# Altium schematic sheet Stepper Motor1.SchDoc
size A2; SheetNumber: 4; SheetTotal: 7
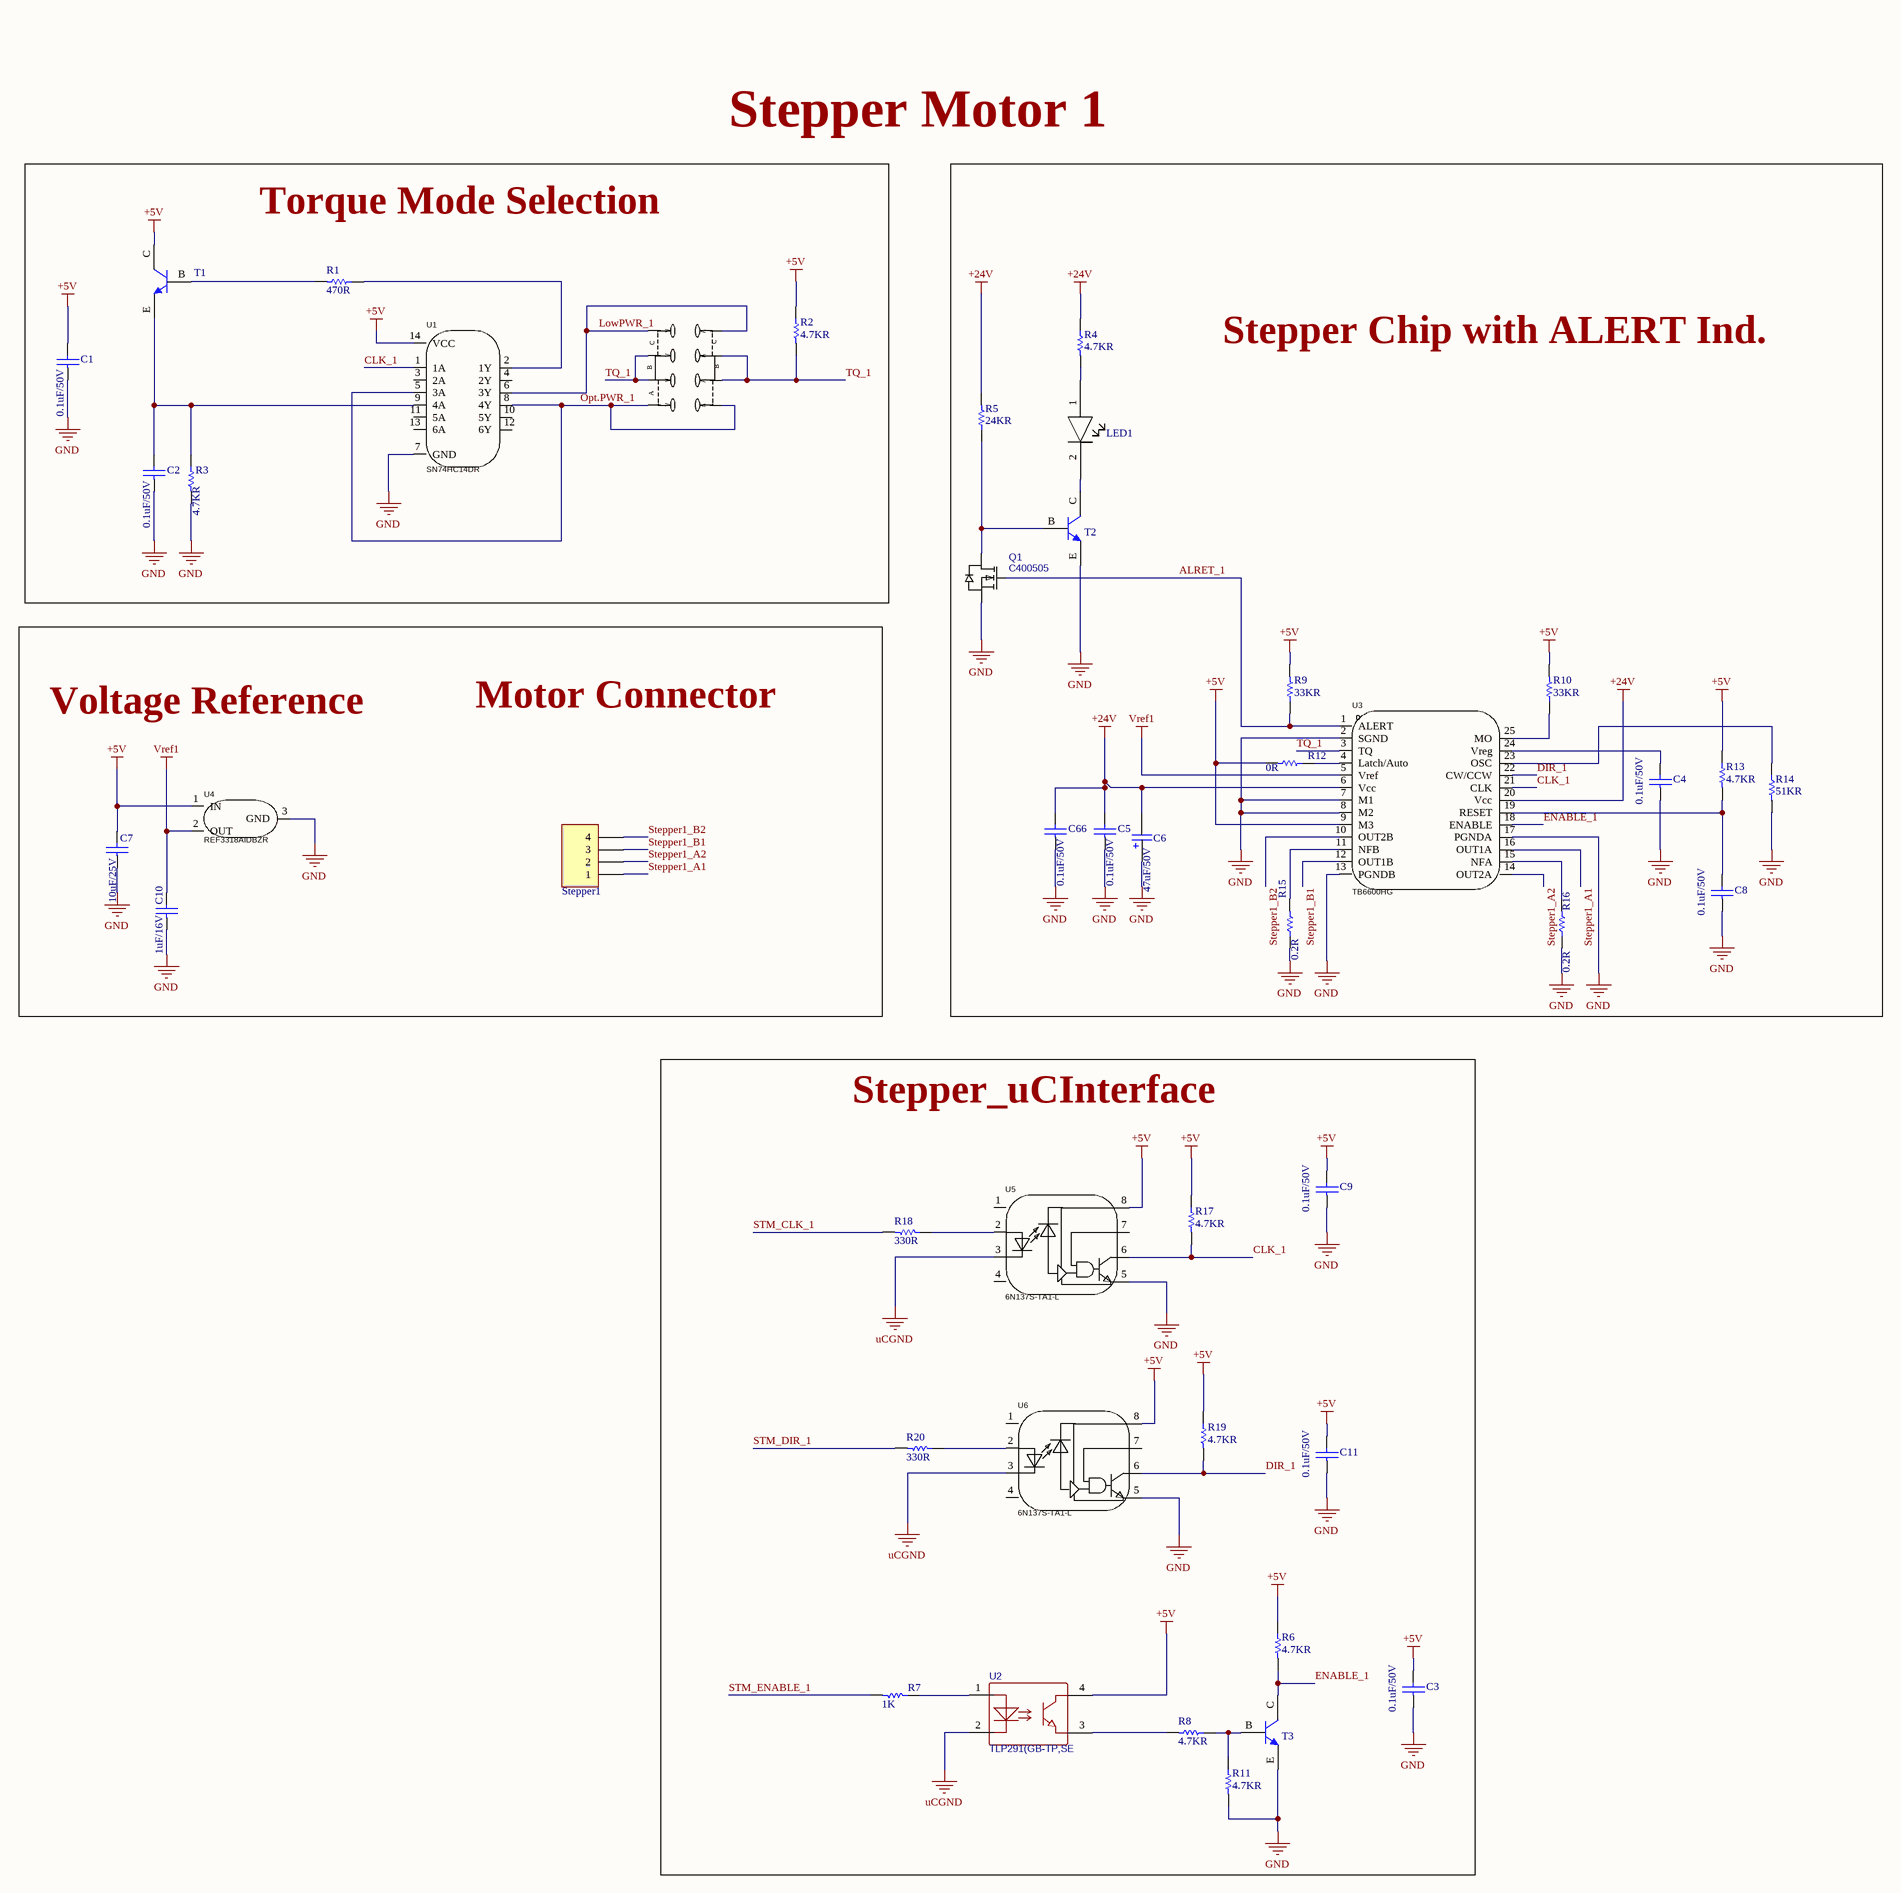
[diagram p0: Stepper Motor1.SchDoc]

## Parts
C1  0.1uF/50V  [PCBComponent_1]
C2  0.1uF/50V  [PCBComponent_1]
C3  0.1uF/50V  [PCBComponent_1]
C4  0.1uF/50V  [PCBComponent_1]
C5  0.1uF/50V  [PCBComponent_1]
C6  47uF/50V  [CAPLEAD_D6.3mm]  (no BOM)
C7  10uF/25V  [PCBComponent_1]
C8  0.1uF/50V  [PCBComponent_1]
C9  0.1uF/50V  [PCBComponent_1]
C10  1uF/16V  [PCBComponent_1]
C11  0.1uF/50V  [PCBComponent_1]
C66  0.1uF/50V  [PCBComponent_1]
LED1  1206 LED  [1206 LED]  (value not drawn)
Q1  C400505  [SOT-23-3_L2.9-W1.3-P1.90-LS2.4-BR]
R1  470R  [RESC1608X06N]
R2  4.7KR  [R0402]
R3  4.7KR  [R0402]
R4  4.7KR  [R0402]
R5  24KR  [RESC1608X06N]
R6  4.7KR  [R0402]
R7  1K  [R0402]
R8  4.7KR  [R0402]
R9  33KR  [RESC1608X06N]
R10  33KR  [RESC1608X06N]
R11  4.7KR  [R0402]
R12  0R  [RESC1608X06N]
R13  4.7KR  [R0402]
R14  51KR  [R0402]
R15  0.2R  [RESC6431X12N]
R16  0.2R  [RESC6431X12N]
R17  4.7KR  [R0402]
R18  330R  [R0402]
R19  4.7KR  [R0402]
R20  330R  [R0402]
Stepper1  Header 4 Pin Polar  [PCBComponent_1]  (value not drawn)  (no BOM)
SW1  MST23D19G2  [SW-SMD_MST23D19G2]  (value not drawn)
T1  MMBT3904 Transistor  [MMBT3904]  (value not drawn)
T2  MMBT3904 Transistor  [MMBT3904]  (value not drawn)
T3  MMBT3904 Transistor  [MMBT3904]  (value not drawn)
U1  SN74HC14DR  [SOIC-14_L8.7-W3.9-P1.27-LS6.0-BL]
U2  TLP291(GB-TP,SE  [SOP-4-1.27mm]
U3  TB6600HG  [HZIP25-P-1.00F]  (no BOM)
U4  REF3318AIDBZR  [SOT-23-3_L2.9-W1.3-P1.90-LS2.4-BR]
U5  6N137S-TA1-L  [SOP-8_L9.8-W6.6-P2.54-LS10.3-BL]
U6  6N137S-TA1-L  [SOP-8_L9.8-W6.6-P2.54-LS10.3-BL]

## Blocks framed on the sheet
Torque Mode Selection: C1 C2 R1-R3 SW1 T1 U1
Stepper Chip with ALERT Ind.: C4-C6 C8 C66 LED1 Q1 R4 R5 R9 R10 R12-R16 T2 U3
Stepper_uCInterface: C3 C9 C11 R6-R8 R11 R17-R20 T3 U2 U5 U6

## Nets
+5V: C1.2 C3.2 C7.2 C9.2 C11.2 R2.1 R6.1 R9.2 R10.2 R12.2 R13.1 R17.1 R19.1 T1.C U1.14(VCC) U2.4 U3.9(M3) U4.1(IN) U5.8 U6.8
+24V: C5.2 C6.2 C66.2 R4.1 R5.2 U3.6(Vcc) U3.20(Vcc)
GND: C1.1 C2.1 C3.1 C4.1 C5.1 C6.1 C7.1 C8.1 C9.1 C10.1 C11.1 C66.1 Q1.2(S) R3.2 R11.2 R14.2 R15.1 R16.1 T2.E T3.E U1.7(GND) U3.2(SGND) U3.7(M1) U3.8(M2) U3.13(PGNDB) U3.17(PGNDA) U4.3(GND) U5.5 U6.5
uCGND: U2.2 U5.3 U6.3
Vref1: C10.2 U3.5(Vref) U4.2(OUT)
ALRET_1: Q1.1(G) R9.1 U3.1(ALERT)
CLK_1: R17.2 U1.1(1A) U3.21(CLK) U5.6
DIR_1: R19.2 U3.22(CW/CCW) U6.6
ENABLE_1: R6.2 T3.C U3.18(ENABLE)
LowPWR_1: SW1.4 SW1.5 U1.6(3Y)
Opt.PWR_1: SW1.1 SW1.8 U1.5(3A) U1.8(4Y)
Stepper1_A1: Stepper1.1 U3.16(OUT1A)
Stepper1_A2: Stepper1.2 U3.14(OUT2A)
Stepper1_B1: Stepper1.3 U3.12(OUT1B)
Stepper1_B2: Stepper1.4 U3.10(OUT2B)
STM_CLK_1: R18.2
STM_DIR_1: R20.2
STM_ENABLE_1: R7.2
TQ_1: R2.2 SW1.2 SW1.3 SW1.6 SW1.7 U3.3(TQ)
NetC2_2: C2.2 R3.1 T1.E U1.9(4A)
NetC4_2: C4.2 U3.24(Vreg)
NetC8_2: C8.2 R13.2 U3.19(RESET)
NetLED1_1: LED1.1 R4.2
NetLED1_2: LED1.2 T2.C
NetQ1_3: Q1.3(D) R5.1 T2.B
NetR1_1: R1.1 U1.2(1Y)
NetR1_2: R1.2 T1.B
NetR7_1: R7.1 U2.1
NetR8_1: R8.1 R11.1 T3.B
NetR8_2: R8.2 U2.3
NetR10_1: R10.1 U3.25(MO)
NetR12_1: R12.1 U3.4(Latch/Auto)
NetR14_1: R14.1 U3.23(OSC)
NetR15_2: R15.2 U3.11(NFB)
NetR16_2: R16.2 U3.15(NFA)
NetR18_1: R18.1 U5.2
NetR20_1: R20.1 U6.2

Not connected (* = marked no-connect by the designer): U1 3(2A) 4(2Y) 10(5Y) 11(5A) 12(6Y) 13(6A); U5 1(NC) 4(NC) 7; U6 1(NC) 4(NC) 7

## Notes on the sheet
- Stepper Motor 1
- Voltage Reference
- Motor Connector
- (in symbol MST23D19G2) C; B; A

## Library data of the parts
C1-C5 C8 C9 C11 C66 = 0603 Capacitor: C1591; Created By: NourAldin; DataSheet Link: https://eu.mouser.com/datasheet/2/400/lcc_automotive_general_en-843974.pdf; Mouser Link: https://eu.mouser.com/ProductDetail/TDK/CGA1A2X7R1H331M030BA?qs=sGAEpiMZZMs0AnBnWHyRQL8L3bkL%252bvtyS9XpSB1mk7rVV5K8%252bbxEeg%3d%3d
C6 = A759EQ475M2AAAE160: C45100; Manufacturer: KEMET; Supplier 1: Mouser; Manufacturer Part Number: A759EQ475M2AAAE160; RoHS: Yes; Category: Polymer Capacitors; Stock 1: 17219; Pricing 1: 1=0.97, 10=0.73, 50=0.73, 100=0.546, 1000=0.384, 10000=0.326 (USD); ComponentLink1URL: http://www.kemet.com/docfinder?Partnumber=A759EQ475M2AAAE160&src-supplier=Digikey; ComponentLink1Description: http://www.kemet.com/docfinder?Partnumber=A759EQ475M2AAAE160&src-supplier=Digikey; ComponentLink2URL: http://www.farnell.com/datasheets/2095614.pdf?src-supplier=Element14; ComponentLink2Description: http://www.farnell.com/datasheets/2095614.pdf?src-supplier=Element14; Supplier Part Number 1: 80-A759EQ475M2AAE160
C7 = 0603 Capacitor: C96446; Created By: NourAldin; DataSheet Link: https://eu.mouser.com/datasheet/2/400/lcc_automotive_general_en-843974.pdf; Mouser Link: https://eu.mouser.com/ProductDetail/TDK/CGA1A2X7R1H331M030BA?qs=sGAEpiMZZMs0AnBnWHyRQL8L3bkL%252bvtyS9XpSB1mk7rVV5K8%252bbxEeg%3d%3d
C10 = 0603 Capacitor: C1592; Created By: NourAldin; DataSheet Link: https://eu.mouser.com/datasheet/2/400/lcc_automotive_general_en-843974.pdf; Mouser Link: https://eu.mouser.com/ProductDetail/TDK/CGA1A2X7R1H331M030BA?qs=sGAEpiMZZMs0AnBnWHyRQL8L3bkL%252bvtyS9XpSB1mk7rVV5K8%252bbxEeg%3d%3d
LED1 = 1206 LED: C434438; Created By: NourAldin
Q1 = BSS138_MOSFET: Manufacturer: YANGJIE(扬杰); Manufacturer Part: BSS138; Contributor: LCSC; Supplier: LCSC; Supplier Part: C400505; JLCPCB Part Class: Extended Part; spicePre: Q; spiceSymbolName: BSS138_C400505
R1 = 0603 Resistor: C114669; Created By: NourAldin; Mouser Link: https://eu.mouser.com/ProductDetail/Panasonic/ERA-3AHD180V?qs=sGAEpiMZZMvdGkrng054t5mej2KPdPuFSlDBd1tSiF0%3d; DataSheet Link: https://eu.mouser.com/datasheet/2/315/AOA0000C307-1149632.pdf
R2-R4 R6 R8 R11 R13 R17 R19 = 0402 Resistor: C105871
R5 = 0603 Resistor: C2930081; Created By: NourAldin; Mouser Link: https://eu.mouser.com/ProductDetail/Panasonic/ERA-3AHD180V?qs=sGAEpiMZZMvdGkrng054t5mej2KPdPuFSlDBd1tSiF0%3d; DataSheet Link: https://eu.mouser.com/datasheet/2/315/AOA0000C307-1149632.pdf
R7 = 0402 Resistor: C106235
R9 R10 = 0603 Resistor: C126359; Created By: NourAldin; Mouser Link: https://eu.mouser.com/ProductDetail/Panasonic/ERA-3AHD180V?qs=sGAEpiMZZMvdGkrng054t5mej2KPdPuFSlDBd1tSiF0%3d; DataSheet Link: https://eu.mouser.com/datasheet/2/315/AOA0000C307-1149632.pdf
R12 = 0603 Resistor: C100044; Created By: NourAldin; Mouser Link: https://eu.mouser.com/ProductDetail/Panasonic/ERA-3AHD180V?qs=sGAEpiMZZMvdGkrng054t5mej2KPdPuFSlDBd1tSiF0%3d; DataSheet Link: https://eu.mouser.com/datasheet/2/315/AOA0000C307-1149632.pdf
R14 = 0402 Resistor: C107230
R15 R16 = 2512 Resistor: C2903473; Created By: NourAldin; Mouser Link: https://eu.mouser.com/ProductDetail/Bourns/CSS2H-2512K-2L00F?qs=sGAEpiMZZMukHu%252bjC5l7YewuupLM8jZrvWs15Y6t0rY%3D&fbclid=IwAR0ZD_uc1Y03YG_KyYG8NxrpBzYgFzVeevvjxrlqtGWJ1HKz-jrYfqlFWCw; DataSheet Link: https://eu.mouser.com/datasheet/2/54/ss2h-2512-1302652.pdf
R18 R20 = 0402 Resistor: C105875
SW1 = MST23D19G2: C431545; Manufacturer: SHOU HAN(首韩); Add into BOM: yes; Circuit: 双刀三掷; Pin Style: SMDSplicing; Switch Length: 12.95mm; Switch Width: 3.55mm; Switch Height: 3.5mm; Current Rating (DC): 100mA; Voltage Rating (DC): 12V; Mechanical Life: 1万次; Symbol: MST23D19G2; Device: MST23D19G2; LCSC Part Name: 三档立式贴片 8脚拨动 柄长2.0MM; Supplier Part: C431545; Manufacturer Part: MST23D19G2; Supplier Footprint: SMD; JLCPCB Part Class: Extended Part; Datasheet: https://atta.szlcsc.com/upload/public/pdf/source/20190925/C431545_A88710AC241B275593C257CF6D595AD7.pdf; Supplier: LCSC; Convert to PCB: yes; Actuator Style: -; Mounting Style: Brick nogging; Actuator Color: -; Current Rating (AC): -; Voltage Rating (AC): -; Operating Temperature: -25℃~+70℃
T1-T3 = MMBT3904 Transistor: C108429; Created By: NourAldin
U1 = SN74HC14DR: C6820; Manufacturer: TI(德州仪器); Add into BOM: yes; Input Type: Schmitt Trigger; Supply Voltage(Single): 2V~6V; Supply Current (Max): 2uA; Number of Circuits: 6; Number of Inputs: 1; Sink Current: 5.2mA; High level range (VIH): 1.5V~4.2V; Low level range (VIL): 300mV~1.2V; Max Propagation Delay: 21ns@6V,50pF; Symbol: SN74HC14DR; Device: SN74HC14DR; LCSC Part Name: 六路施密特触发反相器; Supplier Part: C6820; Manufacturer Part: SN74HC14DR; Supplier Footprint: SOIC-14; JLCPCB Part Class: Extended Part; Datasheet: https://www.ti.com/cn/lit/gpn/sn74hc14; Supplier: LCSC; Convert to PCB: yes; Source Current: 5.2mA; Series: 74HCSeries; Operating Temperature: -40℃~+85℃
U2 = TLP291(GB-TP,SE(T: C55144; BOM_Manufacturer: TOSHIBA(东芝); BOM_Supplier: LCSC; Manufacturer Part Number: TLP291(GB-TP,SE; Supplier Part Number 2: C55144; BOM_JLCPCB Part Class: Extended Part; LCSC Link: https://www.lcsc.com/product-detail/Optocouplers-Phototransistor-Output_TOSHIBA-TLP291-GB-TP-SE_C55144.html; spiceSymbolName: TLP291(GB-TP,SE(T
U3 = TB6600HG: C66042; Manufacturer: TOSHIBA(东芝); Add into BOM: yes; Symbol: TB6600HG; Device: TB6600HG; LCSC Part Name: 4.5A 42V电机驱动芯片; Supplier Part: C66042; Manufacturer Part: TB6600HG; Supplier Footprint: HZIP-25-P-1mm; JLCPCB Part Class: Extended Part; Datasheet: https://atta.szlcsc.com/upload/public/pdf/source/20170511/1494500127812.pdf; Supplier: LCSC; Convert to PCB: yes
U4 = REF3318AIDBZR: C115877; Manufacturer: TI(德州仪器); Add into BOM: yes; Output Type: Fixed; Input Voltage: 2V~5.5V; Output Voltage: 1.8V; Output Current: 5mA; Tolerance: ±0.15%; Temperature Coefficient: 30ppm/℃; Reference Type: series connection; Supply Current: 8.5uA; Noise - 1/10Hz to 10Hz: 50uVp-p; Symbol: REF3318AIDBZR; Device: REF3318AIDBZR; LCSC Part Name: REF3318AIDBZR; Supplier Part: C115877; Manufacturer Part: REF3318AIDBZR; Supplier Footprint: SOT-23; JLCPCB Part Class: Extended Part; Datasheet: https://www.ti.com/cn/lit/gpn/ref3318; Supplier: LCSC; Convert to PCB: yes; Noise - 10Hz to 10kHz: -; Operating Temperature: -40℃~+125℃@(Ta)
U5 U6 = 6N137S-TA1-L: C92651; Manufacturer: LITEON(光宝); Add into BOM: yes; Input Type: DC; Supply Voltage: 4.5V~5.5V; Common Mode Transient Immunity (CMTI): 10kV/us; Data Rate: 15Mbit/s; Propagation Delay tpLH/tpHL: 32ns；40ns; Number of Channels: 1; Symbol: 6N137S-TA1; Device: 6N137S-TA1-L; LCSC Part Name: DC输入 1通道; Supplier Part: C92651; Manufacturer Part: 6N137S-TA1-L; Supplier Footprint: SOP-8-2.54mm; JLCPCB Part Class: Extended Part; Datasheet: https://atta.szlcsc.com/upload/public/pdf/source/20191018/C92651_D1F9F6F1F10C7EC7C3739E5ECB700036.pdf; Supplier: LCSC; Convert to PCB: yes; Operating Temperature: -40℃~+85℃